# EAGLE design 28_main_board_vA (EAGLE 9.0.0)
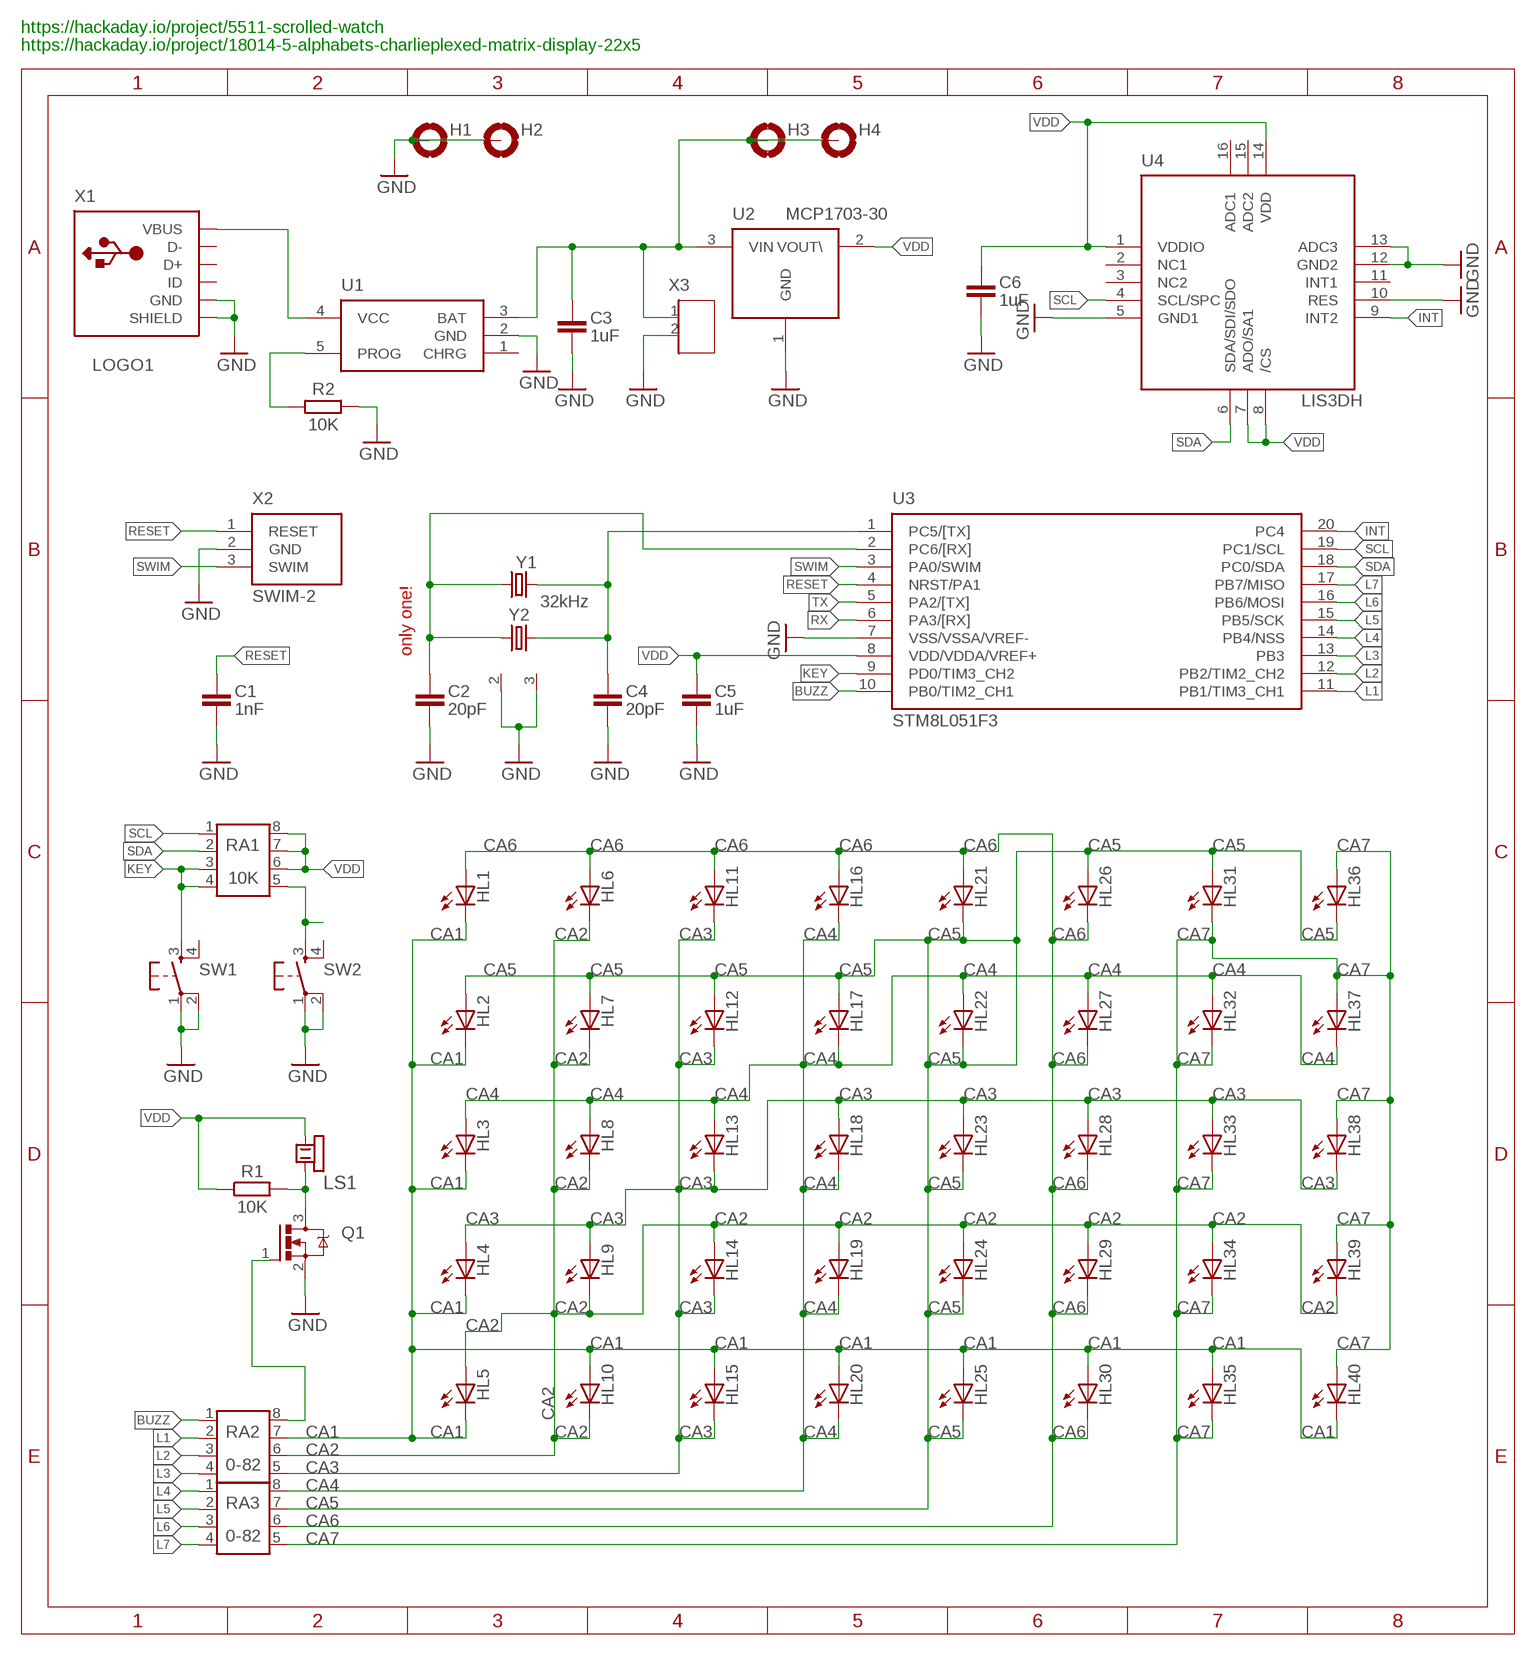
[diagram p0: schematic, sheet 1]

## Parts
C1  1nF  C-EU-C0603  [C0603]
C2  20pF  C-EU-C0402  [C0402]
C3  1uF  C-EU-C0603  [C0603]
C4  20pF  C-EU-C0402  [C0402]
C5  1uF  C-EU-C0603  [C0603]
C6  1uF  C-EU-C0603  [C0603]
H1  MOUNT-PAD-ROUNDVA  [PAD-VA]
H2  MOUNT-PAD-ROUNDVA  [PAD-VA]
H3  MOUNT-PAD-ROUNDVA  [PAD-VA]
H4  MOUNT-PAD-ROUNDVA  [PAD-VA]
HL1  LED0603  [CHIPLED_0603]
HL2  LED0603  [CHIPLED_0603]
HL3  LED0603  [CHIPLED_0603]
HL4  LED0603  [CHIPLED_0603]
HL5  LED0603  [CHIPLED_0603]
HL6  LED0603  [CHIPLED_0603]
HL7  LED0603  [CHIPLED_0603]
HL8  LED0603  [CHIPLED_0603]
HL9  LED0603  [CHIPLED_0603]
HL10  LED0603  [CHIPLED_0603]
HL11  LED0603  [CHIPLED_0603]
HL12  LED0603  [CHIPLED_0603]
HL13  LED0603  [CHIPLED_0603]
HL14  LED0603  [CHIPLED_0603]
HL15  LED0603  [CHIPLED_0603]
HL16  LED0603  [CHIPLED_0603]
HL17  LED0603  [CHIPLED_0603]
HL18  LED0603  [CHIPLED_0603]
HL19  LED0603  [CHIPLED_0603]
HL20  LED0603  [CHIPLED_0603]
HL21  LED0603  [CHIPLED_0603]
HL22  LED0603  [CHIPLED_0603]
HL23  LED0603  [CHIPLED_0603]
HL24  LED0603  [CHIPLED_0603]
HL25  LED0603  [CHIPLED_0603]
HL26  LED0603  [CHIPLED_0603]
HL27  LED0603  [CHIPLED_0603]
HL28  LED0603  [CHIPLED_0603]
HL29  LED0603  [CHIPLED_0603]
HL30  LED0603  [CHIPLED_0603]
HL31  LED0603  [CHIPLED_0603]
HL32  LED0603  [CHIPLED_0603]
HL33  LED0603  [CHIPLED_0603]
HL34  LED0603  [CHIPLED_0603]
HL35  LED0603  [CHIPLED_0603]
HL36  LED0603  [CHIPLED_0603]
HL37  LED0603  [CHIPLED_0603]
HL38  LED0603  [CHIPLED_0603]
HL39  LED0603  [CHIPLED_0603]
HL40  LED0603  [CHIPLED_0603]
LOGO1  LOGO-7  [LOGO_OMEGA_COPPER]
LS1  BUZZER-PIEZO  [BUZZER-PCB-PAD-VA]
Q1  FET_NSOT23  [SOT23-3-1]
R1  10K  R-EU0603  [R0603]
R2  10K  R-EU0402  [R0402]
RA1  10K  R-ARRAY-4X0603  [EXB38V]
RA2  0-82  R-ARRAY-4X0603  [EXB38V]
RA3  0-82  R-ARRAY-4X0603  [EXB38V]
SW1  SWITCH_G2SM  [SW_TACT_SMALL]
SW2  SWITCH_G2SM  [SW_TACT_SMALL]
U1  LTC4054  [SOT23-5L]
U2  MCP1703-30  MCP170XSOT23  [SOT23-3]
U3  STM8L051F3  [TSSOP20]
U4  LIS3DH  [LGA16]
X1  USB-5S-MICRO  [USB-B-MICRO-SMD_V03]
X2  SWIM-2  [ISP-TYPEB-3]
X3  CON-2P-1  [PLS-2.54-2]
Y1  32kHz  REZONATOR-2PIN3215  [XTAL3215]
Y2  REZONATOR-4PIN-SJK-7M  [SJK-7M]

## Nets
BUZZ: RA2.1 U3.10(PB0/TIM2_CH1)
CA1: HL1.C HL2.C HL3.C HL4.C HL5.C HL10.A HL15.A HL20.A HL25.A HL30.A HL35.A HL40.C RA2.7
CA2: HL5.A HL6.C HL7.C HL8.C HL9.C HL10.C HL14.A HL19.A HL24.A HL29.A HL34.A HL39.C RA2.6
CA3: HL4.A HL9.A HL11.C HL12.C HL13.C HL14.C HL15.C HL18.A HL23.A HL28.A HL33.A HL38.C RA2.5
CA4: HL3.A HL8.A HL13.A HL16.C HL17.C HL18.C HL19.C HL20.C HL22.A HL27.A HL32.A HL37.C RA3.8
CA5: HL2.A HL7.A HL12.A HL17.A HL21.C HL22.C HL23.C HL24.C HL25.C HL26.A HL31.A HL36.C RA3.7
CA6: HL1.A HL6.A HL11.A HL16.A HL21.A HL26.C HL27.C HL28.C HL29.C HL30.C RA3.6
CA7: HL31.C HL32.C HL33.C HL34.C HL35.C HL36.A HL37.A HL38.A HL39.A HL40.A RA3.5
GND: C1.2 C2.2 C3.2 C4.2 C5.2 C6.2 H1.1(MOUNT) H2.1(MOUNT) Q1.2(S) R2.1 SW1.1(P) SW1.2(P1) SW2.1(P) SW2.2(P1) U1.2(GND) U2.1(GND) U3.7(VSS/VSSA/VREF-) U4.5(GND1) U4.10(RES) U4.12(GND2) U4.13(ADC3) X1.GND1(GND) X1.SHIELD@1(SHIELD) X1.SHIELD@2(SHIELD) X1.SHIELD@3(SHIELD) X1.SHIELD@4(SHIELD) X1.SHIELD@5(SHIELD) X2.2(GND) X3.2 Y2.2(S) Y2.3(S)
INT: U3.20(PC4) U4.9(INT2)
KEY: RA1.3 RA1.4 SW1.3(S) U3.9(PD0/TIM3_CH2)
L1: RA2.2 U3.11(PB1/TIM3_CH1)
L2: RA2.3 U3.12(PB2/TIM2_CH2)
L3: RA2.4 U3.13(PB3)
L4: RA3.1 U3.14(PB4/NSS)
L5: RA3.2 U3.15(PB5/SCK)
L6: RA3.3 U3.16(PB6/MOSI)
L7: RA3.4 U3.17(PB7/MISO)
N$1: C4.1 U3.1(PC5/[TX]) Y1.1 Y2.4
N$2: C2.1 U3.2(PC6/[RX]) Y1.2 Y2.1
N$5: R2.2 U1.5(PROG)
N$10: Q1.1(G) RA2.8
N$18: LS1.2 Q1.3(D) R1.2
N$20: RA1.5 SW2.3(S)
RESET: C1.1 U3.4(NRST/PA1) X2.1(RESET)
RX: U3.6(PA3/[RX])
SCL: RA1.1 U3.19(PC1/SCL) U4.4(SCL/SPC)
SDA: RA1.2 U3.18(PC0/SDA) U4.6(SDA/SDI/SDO)
SWIM: U3.3(PA0/SWIM) X2.3(SWIM)
TX: U3.5(PA2/[TX])
VCC: C3.1 H3.1(MOUNT) H4.1(MOUNT) U1.3(BAT) U2.3(VIN) X3.1
VDD: C5.1 C6.1 LS1.1 R1.1 RA1.6 RA1.7 RA1.8 U2.2(VOUT\) U3.8(VDD/VDDA/VREF+) U4.1(VDDIO) U4.7(ADO/SA1) U4.8(/CS) U4.14(VDD)
VUSB: U1.4(VCC) X1.VBUS1(VBUS)
Unconnected: SW1.4(S1) SW2.4(S1) U1.1(CHRG) U4.2(NC1) U4.3(NC2) U4.11(INT1) U4.15(ADC2) U4.16(ADC1) X1.D+1(D+) X1.D-1(D-) X1.ID1(ID)

## Notes on the sheet
- https://hackaday.io/project/5511-scrolled-watch
- https://hackaday.io/project/18014-5-alphabets-charlieplexed-matrix-display-22x5
- only one!

## Library data of the parts
C1-C6 = !ht3_passive:C-EU: CAPACITOR, European symbol
H1-H4 = !ht3_mehanical:MOUNT-PAD-ROUND: MOUNTING PAD, round
HL1-HL40 = !ht3_leds:LED: LED OSRAM: - CHIPLED LG R971, LG N971, LY N971, LG Q971, LY Q971, LO R971, LY R971 LH N974, LH R974 LS Q976, LO Q976, LY Q976 LO Q996 - Hyper CHIPLED LW Q18S LB Q993, LB Q99A, LB R99A - SideLED LS A670, LO A670, LY A670, LG A670, LP A670 LB A673, LV A673, LT A673, LW A673 LH A674 LY A675 LS A676, LA A676, LO A676, LY A676, LW A676 LS A679, LY A679, LG A679 - Hyper Micro SIDELED® LS Y876, LA Y876, LO Y876, LY Y876 LT Y87S - SmartLED LW L88C, LW L88S LB L89C, LB L89S, LG L890 LS L89K, LO L89K, LY L89K LS L896, LA L896, LO L896, LY L896 - TOPLED LS T670, LO T670, LY T670, LG T670, LP T670 LSG T670, LSP T670, LSY T670, LOP T670, LYG T670 LG T671, LOG T671, LSG T671 LB T673, LV T673, LT T673, LW T673 LH T674 LS T676, LA T676, LO T676, LY T676, LB T676, LH T676, LSB T676, LW T676 LB T67C, LV T67C, LT T67C, LS T67K, LO T67K, LY T67K, LW E67C LS E67B, LA E67B, LO E67B, LY E67B, LB E67C, LV E67C, LT E67C LW T67C LS T679, LY T679, LG T679 LS T770, LO T770, LY T770, LG T770, LP T770 LB T773, LV T773, LT T773, LW T773 LH T774 LS E675, LA E675, LY E675, LS T675 LS T776, LA T776, LO T776, LY T776, LB T776 LHGB T686 LT T68C, LB T68C - Hyper Mini TOPLED® LB M676 - Mini TOPLED Santana® LG M470 LS M47K, LO M47K, LY M47K Source: http://www.osram.convergy.de LUXEON: - LUMILED® LXK2-PW12-R00, LXK2-PW12-S00, LXK2-PW14-U00, LXK2-PW14-V00 LXK2-PM12-R00, LXK2-PM12-S00, LXK2-PM14-U00 LXK2-PE12-Q00, LXK2-PE12-R00, LXK2-PE12-S00, LXK2-PE14-T00, LXK2-PE14-U00 LXK2-PB12-K00, LXK2-PB12-L00, LXK2-PB12-M00, LXK2-PB14-N00, LXK2-PB14-P00, LXK2-PB14-Q00 LXK2-PR12-L00, LXK2-PR12-M00, LXK2-PR14-Q00, LXK2-PR14-R00 LXK2-PD12-Q00, LXK2-PD12-R00, LXK2-PD12-S00 LXK2-PH12-R00, LXK2-PH12-S00 LXK2-PL12-P00, LXK2-PL12-Q00, LXK2-PL12-R00 Source: www.luxeon.com KINGBRIGHT: KA-3528ASYC Source: www.kingbright.com
LOGO1 = !ht3_misc:LOGO
LS1 = !ht3_misc:BUZZER-PIEZO: Piezo buzzer
Q1 = !ht3_transistor:FET_N
R1 R2 = !ht3_passive:R-EU: RESISTOR, European symbol
RA1-RA3 = !ht3_passive:R-ARRAY-4X: Chip Resistor Array 4 Single Resistor Source: http://www.ctscorp.com/components/Datasheets/CTSChipArrayDs.pdf
SW1 SW2 = !ht3_switchers:SWITCH_G2: B3F-40XX OMRON SWITCH
U1 = !ht3_ic:LTC4054
U2 = !ht3_ic:MCP170X: http://ww1.microchip.com/downloads/en/DeviceDoc/20001826C.pdf Analog - XC6206
U3 = !ht3_ic:STM8L051F3: http://www.kosmodrom.com.ua/pdf/STM8L051F3P6.pdf
U4 = !ht3_ic:LIS3DH
X1 = !ht3_connectors:USB-5S: USB Connectors USBMINIB - Surface Mount Female Mini-B USB Connector 4UConnector: 06564 By microbuilder.eu Thru-hole RA Female Mini-B USB Connector 4UConnector: 18732 By ladyada.net
X2 = !ht3_connectors:SWIM: In system programming x-ter for STM8
X3 = !ht3_connectors:CON-2P
Y1 = !ht3_misc:REZONATOR-2PIN: CRYSTAL
Y2 = !ht3_misc:REZONATOR-4PIN: CRYSTAL

## Board
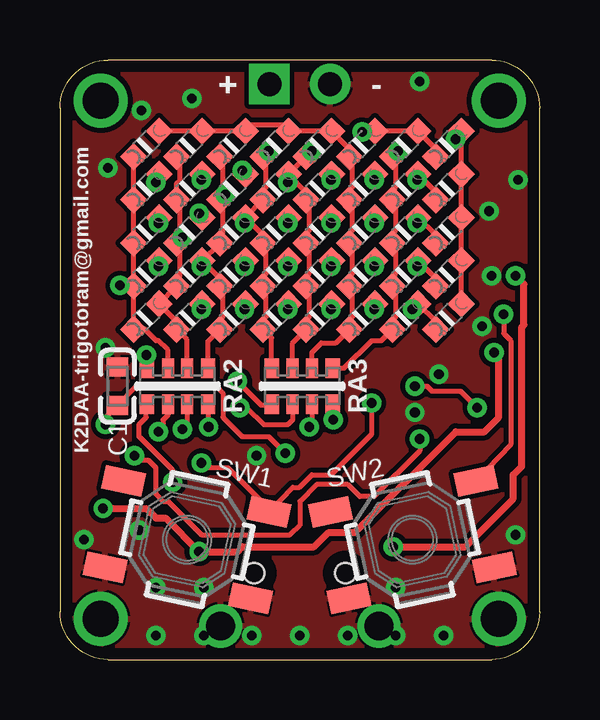
[diagram p1: board, top side]
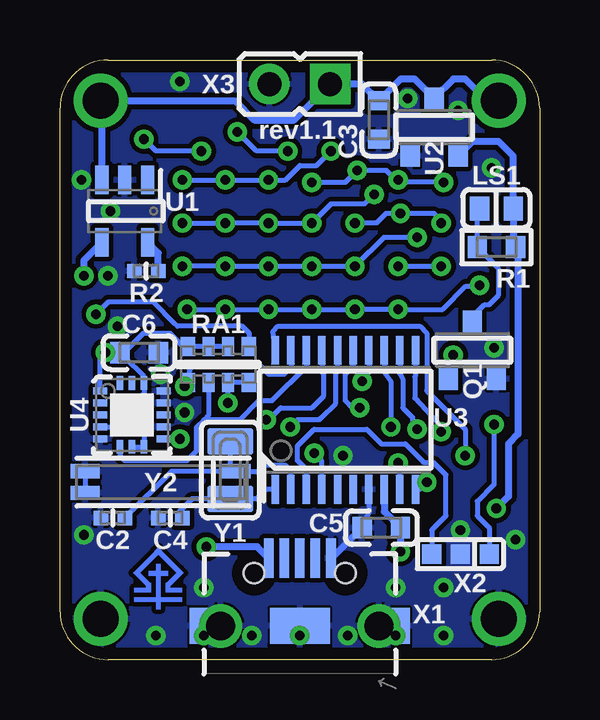
[diagram p2: board, bottom side, seen from below]

Size 20 x 25 mm. Coordinates in mm from the lower left corner, seen from the top.
Outline: 2,0 18,0 arc90 20,2 20,23 arc90 18,25 2,25 arc90 0,23 0,2 arc90 2,0
Copper layers (1*16): Top 0.035mm / dielectric 1.5mm / Bottom 0.035mm
Design rules "rules_OSHPARK_MIN *": minimum track width 0.2mm, minimum drill 0.4mm, track to track 0.2mm, track to pad 0.2mm, pad to pad 0.2mm, via to via 0.2mm, smd to smd 0.2mm, copper to edge 0.5mm, drill to drill 0.2mm, minimum pad ring 10mil, minimum via ring 8mil, stop-mask expansion 0.05mm, vias tented up to drill 0.6mm, thermal gap 0.1mm

### Footprints (pad centres in the part's own frame; a part is rotated, then mirrored left to right if it is on the bottom)
C0603 = smd 0.8 x 0.9: 1 -0.8,0; 2 0.8,0
C0402 = smd 0.6 x 0.6: 1 -0.5,0; 2 0.5,0
PAD-VA = drill 1.5 pad 2.2: 1 0,0
CHIPLED_0603 = smd 0.8 x 0.8: A 0,-0.75; C 0,0.75
BUZZER-PCB-PAD-VA = smd 0.8 x 1: 1 -0.7,0; 2 0.7,0
SOT23-3-1 = smd 0.8 x 0.9: 1 -1,-1.2; 2 1,-1.2; 3 0,1.2
R0603 = smd 0.8 x 0.9: 1 -0.8,0; 2 0.8,0
R0402 = smd 0.6 x 0.6: 1 -0.5,0; 2 0.5,0
EXB38V = smd 0.6 x 0.8: 1 -1.275,-0.75; 4 1.275,-0.75; 5 1.275,0.75; 8 -1.275,0.75 | smd 0.5 x 0.8: 2 -0.4,-0.75; 3 0.4,-0.75; 6 0.4,0.75; 7 -0.4,0.75
SW_TACT_SMALL = smd 1.7 x 1: 1 -3.1,1.85; 2 3.1,1.85; 3 -3.1,-1.85; 4 3.1,-1.85
SOT23-5L = smd 0.55 x 1.2: 1 -0.95,-1.3; 2 0,-1.3; 3 0.95,-1.3; 4 0.95,1.3; 5 -0.95,1.3
SOT23-3 = smd 0.8 x 0.9: 1 -1,-1.2; 2 1,-1.2; 3 0,1.2
TSSOP20 = smd 0.31 x 1.2: 1 -2.925,-2.9; 2 -2.275,-2.9; 3 -1.625,-2.9; 4 -0.975,-2.9; 5 -0.325,-2.9; 6 0.325,-2.9; 7 0.975,-2.9; 8 1.625,-2.9; 9 2.275,-2.9; 10 2.925,-2.9; 11 2.925,2.9; 12 2.275,2.9; 13 1.625,2.9; 14 0.975,2.9; 15 0.325,2.9; 16 -0.325,2.9; 17 -0.975,2.9; 18 -1.625,2.9; 19 -2.275,2.9 | smd 0.3 x 1.2: 20 -2.925,2.9
LGA16 = smd 0.58 x 0.28: 1 -1.325,1; 2 -1.325,0.5; 3 -1.325,0; 4 -1.325,-0.5; 5 -1.325,-1; 9 1.325,-1; 10 1.325,-0.5; 11 1.325,0; 12 1.325,0.5; 13 1.325,1 | smd 0.28 x 0.58: 6 -0.5,-1.325; 7 0,-1.325; 8 0.5,-1.325; 14 0.5,1.325; 15 0,1.325; 16 -0.5,1.325
USB-B-MICRO-SMD_V03 = smd 0.4 x 1.65: D+1 0,-2.825; D-1 0.65,-2.825; GND1 -1.3,-2.825; ID1 -0.65,-2.825; VBUS1 1.3,-2.825 | smd 1.8 x 1.5: SHIELD@1 3.685,0; SHIELD@2 -3.685,0 | smd 2.5 x 1.5: SHIELD@3 0,0 | drill 1.2 pad 1.6: SHIELD@4 -3.3,0; SHIELD@5 3.3,0 | hole 0.85: 1.9,-2.2; -1.9,-2.2
ISP-TYPEB-3 = smd 0.8 x 0.8: 1 -1.2,0; 2 0,0; 3 1.2,0
PLS-2.54-2 = drill 1 pad 1.7 square: 1 -1.27,0 | drill 1 pad 1.7: 2 1.27,0
XTAL3215 = smd 1.1 x 1.9: 1 -1.2,0; 2 1.2,0
SJK-7M = smd 1.2 x 0.6: 1 -3.15,-0.45; 2 3.15,-0.45; 3 3.15,0.45; 4 -3.15,0.45

### Placement (x,y rotation side)
C1  2.4,11.4 90 top
C2  17.8,5.9 180 bottom
C3  6.7,22.5 270 bottom
C4  15.4,5.9 180 bottom
C5  6.6,5.5 180 bottom
C6  16.7,12.8 0 bottom
H1  1.7,1.7 0 top
H2  18.3,1.7 0 top
H3  1.7,23.3 0 top
H4  18.3,23.3 0 top
HL1  3.6,21.5 135 top
HL2  3.6,19.7 135 top
HL3  3.6,17.9 135 top
HL4  3.6,16.1 135 top
HL5  3.6,14.3 135 top
HL6  5.4,21.5 135 top
HL7  5.4,19.7 135 top
HL8  5.4,17.9 135 top
HL9  5.4,16.1 135 top
HL10  5.4,14.3 135 top
HL11  7.2,21.5 135 top
HL12  7.2,19.7 135 top
HL13  7.2,17.9 135 top
HL14  7.2,16.1 135 top
HL15  7.2,14.3 135 top
HL16  9,21.5 135 top
HL17  9,19.7 135 top
HL18  9,17.9 135 top
HL19  9,16.1 135 top
HL20  9,14.3 135 top
HL21  10.8,21.5 135 top
HL22  10.8,19.7 135 top
HL23  10.8,17.9 135 top
HL24  10.8,16.1 135 top
HL25  10.8,14.3 135 top
HL26  12.6,21.5 135 top
HL27  12.6,19.7 135 top
HL28  12.6,17.9 135 top
HL29  12.6,16.1 135 top
HL30  12.6,14.3 135 top
HL31  14.4,21.5 135 top
HL32  14.4,19.7 135 top
HL33  14.4,17.9 135 top
HL34  14.4,16.1 135 top
HL35  14.4,14.3 135 top
HL36  16.2,21.5 135 top
HL37  16.2,19.7 135 top
HL38  16.2,17.9 135 top
HL39  16.2,16.1 135 top
HL40  16.2,14.3 135 top
LOGO1  15.9,2.9 0 bottom
LS1  1.8,18.8 180 bottom
Q1  2.8,12.9 0 bottom
R1  1.8,17.2 180 bottom
R2  16.4,16.2 0 bottom
RA1  13.4,12.3 0 bottom
RA2  4.9,11.4 0 top
RA3  10.1,11.4 0 top
SW1  5.3,5 168 top
SW2  14.7,5 192 top
U1  17.3,18.7 180 bottom
U2  4.4,22.2 0 bottom
U3  8.1,10 0 bottom
U4  17,10.2 0 bottom
X1  10,1.4 180 bottom
X2  3.3,4.4 180 bottom
X3  10,24 180 bottom
Y1  12.9,7.9 90 bottom
Y2  15.8,7.4 180 bottom

### Tracks (layer width: path | path; a pad name or v marks a point on that pad's centre or on a via)
B
  Bottom 0.2: 18.95,7.85 18.95,6.95
BUZZ  (via drill 0.4 pad 0.8)
  Top 0.2: v4.7,7.4 4.7,7.9 3.3,9.3 3.3,9.8 3.6,10.1 3.6,10.62 RA2.1
  Bottom 0.2: U3.10 5,7.1 v4.7,7.4
CA1  (via drill 0.4 pad 0.8)
  Top 0.2: HL40.C 15.67,14.09 HL35.A 14.93,14.73 v14.7,14.6 | HL5.C HL4.C | HL4.C HL3.C HL2.C HL1.C | HL5.C 3.23,13.77 | HL10.A 5.93,14.73 v5.9,14.6 | v7.7,14.6 7.9,14.6 HL15.A | HL20.A 9.53,14.73 v9.5,14.6 | HL25.A 11.33,14.73 v11.3,14.6 | HL30.A 13.13,14.73 v13.1,14.6 | HL5.C 3.1,13.8 3.5,13.8 4,13.3 4.1,13.3 4.5,12.9 RA2.7 | v2.5,15.6 3.04,15.6 HL4.C
  Bottom 0.2: v14.7,14.6 v13.1,14.6 v11.3,14.6 v9.5,14.6 v7.7,14.6 v5.9,14.6 4.04,14.6 HL4.C 2.53,15.57 v2.5,15.6
CA2  (via drill 0.4 pad 0.8)
  Top 0.2: 5,17.24 5,16 4.87,15.87 HL9.C HL5.A 4.87,14.09 HL10.C 5.3,13.34 RA2.6 | 5,17.24 HL8.C 4.87,17.87 5,18 5,19.04 HL7.C 4.87,19.87 5,20 5,20.84 HL6.C | HL39.C 15.67,15.89 HL34.A | HL34.A 14.93,16.53 | v11.3,16.4 11.2,16.5 HL24.A | HL29.A 13.13,16.53 v13.1,16.4 | HL19.A 9.53,16.53 v9.5,16.4 | v14.9,16.4 14.9,16.6 HL34.A | v7.7,16.4 7.7,16.6 HL14.A | 5,17.24 5,17.6 v5.1,17.6
  Bottom 0.2: v14.9,16.4 v13.1,16.4 v11.3,16.4 v9.5,16.4 v7.7,16.4 6.5,17.6 v5.1,17.6
CA3  (via drill 0.4 pad 0.8)
  Top 0.2: 6.6,13.7 HL15.C | HL12.C 6.67,19.57 6.8,19.7 6.8,20.84 HL11.C | HL9.A 6.67,15.89 HL14.C 6.8,15.44 6.8,14.3 6.67,14.17 HL15.C | HL9.A HL13.C 6.67,17.67 6.8,17.8 6.8,19.04 HL12.C | HL12.C v6.9,19.4 | HL9.A 5.93,16.53 v5.9,16.4 | v4.1,16.4 3.9,16.4 HL4.A | HL38.C 15.67,17.69 HL33.A | 15.03,18.53 HL33.A | HL33.A v14.9,18.2 | v13.1,18.2 HL28.A | v11.3,18.2 11.3,18.4 HL23.A | HL18.A 9.53,18.33 v9.5,18.2 | RA2.5 6.17,13.28 HL15.C
  Bottom 0.2: v6.9,19.4 7.3,19 8.7,19 v9.5,18.2 v11.3,18.2 v13.1,18.2 v14.9,18.2 | v5.9,16.4 v4.1,16.4
CA4  (via drill 0.4 pad 0.8)
  Top 0.2: HL13.A 8.47,17.69 HL18.C 8.6,17.24 8.6,16.1 8.47,15.97 HL19.C 8.6,15.44 8.6,14.3 8.47,14.17 HL20.C 8.82,13.41 RA3.8 | HL13.A HL17.C 8.47,19.57 8.6,19.7 8.6,20.84 HL16.C v8.7,21.2 8.9,21.4 | HL37.C 15.67,19.49 HL32.A 14.93,20.13 v14.9,20 | HL3.A 4.13,18.33 v4.1,18.2 | v5.8,18.6 5.96,18.6 HL8.A | HL13.A 7.73,18.33 v7.7,18.2 | HL22.A 11.33,20.13 v11.3,20 | HL27.A 13.13,20.03 v13.1,20
  Bottom 0.2: v14.9,20 v13.1,20 v11.3,20 10.6,20 10,20.6 9.3,20.6 v8.7,21.2 | v4.1,18.2 4.1,18.3 4.4,18.6 v5.8,18.6 6.4,18.6 6.8,18.2 v7.7,18.2
CA5  (via drill 0.4 pad 0.8)
  Top 0.2: HL17.A 10.27,19.49 HL22.C 10.4,19.04 10.4,17.9 10.27,17.77 HL23.C 10.4,17.24 10.4,16.1 10.27,15.97 HL24.C 10.4,15.44 10.4,14.3 10.27,14.17 HL25.C 9.7,13.2 RA3.7 | HL17.A HL21.C v10.5,21.2 | HL36.C 15.67,21.29 HL31.A HL26.A 13.1,22.1 v12.6,22 | 7.5,20.46 HL12.A 7.7,20.2 v7.6,20.4 | HL2.A 4.13,20.13 v4,19.9 | v5.9,20 HL7.A | HL17.A 9.53,20.13 v9.5,19.9
  Bottom 0.2: v9.5,19.9 8.1,19.9 v7.6,20.4 6.4,20.4 6,20 v5.9,20 5.8,19.9 v4,19.9 | v10.5,21.2 11.8,21.2 v12.6,22
CA6
  Top 0.2: HL1.A HL6.A HL11.A 8,22.3 9.26,22.3 HL16.A HL21.A 12.07,21.29 HL26.C 12.2,20.84 12.2,19.7 12.07,19.57 HL27.C 12.2,19.04 12.2,17.9 12.07,17.77 HL28.C 12.2,17.24 12.2,16.1 12.07,15.97 HL29.C 12.2,15.44 12.2,14.3 12.07,14.17 HL30.C 11.5,13.2 10.9,13.2 10.5,12.8 RA3.6
CA7  (via drill 0.4 pad 0.8)
  Top 0.2: HL35.C 13.87,14.17 14,14.3 14,15.44 HL34.C 13.87,15.97 14,16.1 14,17.24 HL33.C 13.87,17.77 14,17.9 14,19.04 HL32.C 13.87,19.57 14,19.7 14,20.84 HL31.C v14.1,21.2 | HL40.A HL39.A HL38.A HL37.A HL36.A 16.76,22 v16.5,21.7 | HL35.C 13.57,13.77 | HL35.C 13.4,13.3 13,13.3 11.85,12.15 RA3.5
  Bottom 0.2: v14.1,21.2 16,21.2 v16.5,21.7
GND  (via drill 0.4 pad 0.8)
  Bottom 0.2: U3.7 7.12,6.17 C5.2
  Bottom 0.3: X1.GND1 8.7,4.2 C5.2
  other vias: 19,5.2 3.3,5.4 14.8,10.3 17.6,13.9 1.9,13 10,1 12,1 14,1 16,1 8,1 4,1 19.1,20 2,20.5 18,16 6,1 4,3 6,3 14,3 1,5 5.5,23.4 8.2,8.5 15.8,11.9 17.9,18.7 3.4,22.9 15,24.1
  pour Bottom: -1,26 21,26 21,-1 -1,-1
  pour Top: -2,27 22,27 22,-2 -2,-2
INT  (via drill 0.4 pad 0.8)
  Top 0.2: v15,9.2 15,8.7 13.1,6.8 12.5,6.8 12,7.3 10.7,7.3 10,6.6 10,5.6 9.6,5.2 5.9,5.2 4.5,6.6 4.3,6.6 4,6.9 4,8 3.7,8.3 3.3,8.3 v3.1,8.5
  Bottom 0.2: U4.9 v15,9.2 | U3.20 11.12,13.68 10.9,13.9 5,13.9 4.7,13.6 4.7,11.2 3.1,9.6 v3.1,8.5
KEY  (via drill 0.4 pad 0.8)
  Top 0.2: v5.9,8.2 6.1,8 7,8 8.73,6.27 SW1.3 9.7,7.19 9.99,7.19 10.5,7.7 11.3,7.7 13,9.4 v13,10.7
  Bottom 0.2: RA1.4 RA1.3 v13,10.7 | U3.9 5.83,8.07 v5.9,8.2
L1  (via drill 0.4 pad 0.8)
  Top 0.2: RA2.2 4.5,10.2 4.3,10 4.3,9.7 v4.1,9.5
  Bottom 0.2: U3.11 5.17,11.82 5.2,11.8 5.2,10.9 4.1,9.7 v4.1,9.5
L2  (via drill 0.4 pad 0.8)
  Top 0.2: RA2.3 5.3,9.8 v5.1,9.6
  Bottom 0.2: U3.12 5.83,11.93 5.7,11.7 5.7,10.5 5.3,10.1 5.3,9.8 v5.1,9.6
L3  (via drill 0.4 pad 0.8)
  Top 0.2: RA2.4 6.17,9.72 v6.2,9.7
  Bottom 0.2: U3.13 6.47,11.97 6.2,11.6 v6.2,9.7
L4  (via drill 0.4 pad 0.8)
  Top 0.2: RA3.1 8.7,10.6 8.4,10.6 v7.4,11.6
  Bottom 0.2: U3.14 7.12,11.97 v7.4,11.6
L5  (via drill 0.4 pad 0.8)
  Top 0.2: RA3.2 9.7,10 9.5,9.8 8.5,9.8 7.8,10.5 v7.5,10.5
  Bottom 0.2: v7.5,10.5 7.8,10.5 8.1,10.8 8.1,11.9 7.78,12.22 U3.15
L6  (via drill 0.4 pad 0.8)
  Top 0.2: RA3.3 10.5,9.8 v10.4,9.7
  Bottom 0.2: U3.16 8.43,12.1 8.5,12.03 | v10.4,9.7 10.1,10 9.2,10 9.09,10.1 8.5,10.69 8.5,11.9 8.5,12.03 | 8.5,12.03 8.5,12.07 8.45,12.12
L7  (via drill 0.4 pad 0.8)
  Top 0.2: RA3.4 11.3,10.1 v11.4,10
  Bottom 0.2: v11.4,10 11.3,10 10.8,10.5 9.5,10.5 9,11 9,11.9 9.07,11.97 U3.17
N$1
  Bottom 0.2: C4.1 15,6.2 14.5,6.7 Y1.1 13.05,6.65 Y2.4 12.4,6.7 11.8,6.7 11.4,7.1 U3.1
N$2
  Bottom 0.2: C2.1 15.35,7.85 Y2.1 | Y1.2 12.9,7.9 Y2.1 | Y2.1 11.75,7.85 11.5,8.1 10.6,8.1 10.38,7.88 U3.2
N$5
  Bottom 0.3: R2.2 15.9,16.95 U1.5
N$10  (via drill 0.4 pad 0.8)
  Top 0.2: RA2.8 3.8,12.5 v3.6,12.7
  Bottom 0.2: Q1.1 3.8,12.5 v3.6,12.7
N$18
  Bottom 0.2: Q1.3 2.8,14.3 2.3,14.8 2.1,14.8 1.7,15.2 1.7,16.3 R1.2 2.6,18.7 LS1.2
N$20  (via drill 0.4 pad 0.8)
  Top 0.2: v18.5,14.4 18.5,13.6 18.8,13.3 18.8,8.97 SW2.3
  Bottom 0.2: RA1.5 12.1,13.6 12.4,13.9 15.1,13.9 15.2,14 16.1,14.9 18,14.9 v18.5,14.4
RESET  (via drill 0.4 pad 0.8)
  Top 0.2: v9.4,8.6 8.7,9.3 7.6,9.3 6.8,10.1 6.8,11.1 6.5,11.4 3.2,11.4 C1.1 1.9,10.1 v1.9,9.8
  Bottom 0.2: v1.9,9.8 1.9,7.3 2.6,6.6 2.6,6 2.1,5.5 X2.1 | U3.4 9.07,8.28 v9.4,8.6
SCL  (via drill 0.4 pad 0.6, 0.4 pad 0.8)
  Top 0.2: v17.4,10.5 16.7,11.2 15.51,11.2 15.31,11.4 v14.8,11.4
  Bottom 0.2: v14.8,11.4 RA1.1 14.6,12.1 14.4,12.3 11.7,12.3 11.3,11.9 10.65,11.9 10.38,12.18 U3.19 | U4.4 17.7,9.7 17.4,10 v17.4,10.5
SDA
  Bottom 0.2: 14,10 12.5,10 11.7,10.8 11.15,10.8 9.72,12.22 U3.18 | U4.6 17.5,8.5 17.3,8.3 14.7,8.3 14.3,8.7 14.3,9.7 14,10 | RA1.2 13.8,10.2 14,10
SWIM
  Bottom 0.2: X2.3 4.5,5.4 3.9,6 3.9,7.7 4.4,8.2 4.8,8.2 5.6,9 6.6,9 7.2,9.6 9.4,9.6 10.1,8.9 10.1,8.3 9.72,7.92 U3.3
VCC
  Bottom 0.3: U1.3 18.25,23.25 H4.1 12.7,23.3 11.9,22.5 10.23,22.5 X3.1 7.4,24 C3.1 5.8,24.2 5.2,24.2 U2.3 3.6,24.2 3.1,24.2 2.2,23.3 H3.1
VDD  (via drill 0.4 pad 0.8)
  Top 0.3: v18.1,12.8 18.3,12.5 18.3,10.1 17.7,9.5 16.5,9.5 12.3,5.3 11.2,5.3 10.6,4.7 7.6,4.7 7.4,4.5 v5.8,4.5 4.4,5.9 4,5.9 3.6,6.3 v1.8,6.3
  Bottom 0.2: RA1.6 RA1.7 RA1.8 14.9,13.1 15.4,13.6 16.54,13.6 17.27,12.87 17.3,12.6 | U3.8 6.47,6.47 | 17.3,12.6 16.5,11.8 U4.14 16.5,11.1 16.7,10.9 16.7,9.6 16.5,9.4 U4.8 U4.7 | U4.1 18.32,12.57 v18.1,12.8 C6.1 17.3,12.6
  Bottom 0.3: 6.47,6.47 6.47,6.17 C5.1 v5.8,4.5 | v1.8,6.3 1.3,6.8 1.3,9 0.9,9.4 0.9,16.9 1,17 R1.1 1.1,17.3 LS1.1 1.1,21 1.7,21.6 2.8,21.6 U2.2
VUSB  (via drill 0.4 pad 0.8)
  Top 0.3: v13.9,4.7 16.9,4.7 18.9,6.7 18.9,7.7 19.25,8.05 19.25,8.79 19.25,8.97 19.25,13.85 19.35,13.95 19.35,15.65 v19,16 v19.01,16
  Bottom 0.3: X1.VBUS1 11.78,4.7 v13.9,4.7 | U1.4 19.01,16.64 v19.01,16

### Text on the board
tPlace: + | - | K2DAA-trigotoram@gmail.com
bPlace: rev1.1
_tsilk: X3 | RA3 | RA2 | C5 | SW1 | SW2
_bsilk: DA1 | BUZ1 | R3 | RA1 | VT1 | C1 | U2 | U1 | ZQ1 | C4 | C2 | R2 | R1 | X2 | X1 | C3